# EAGLE design 64ch_16ch_adapterboard (EAGLE 7.2.0)
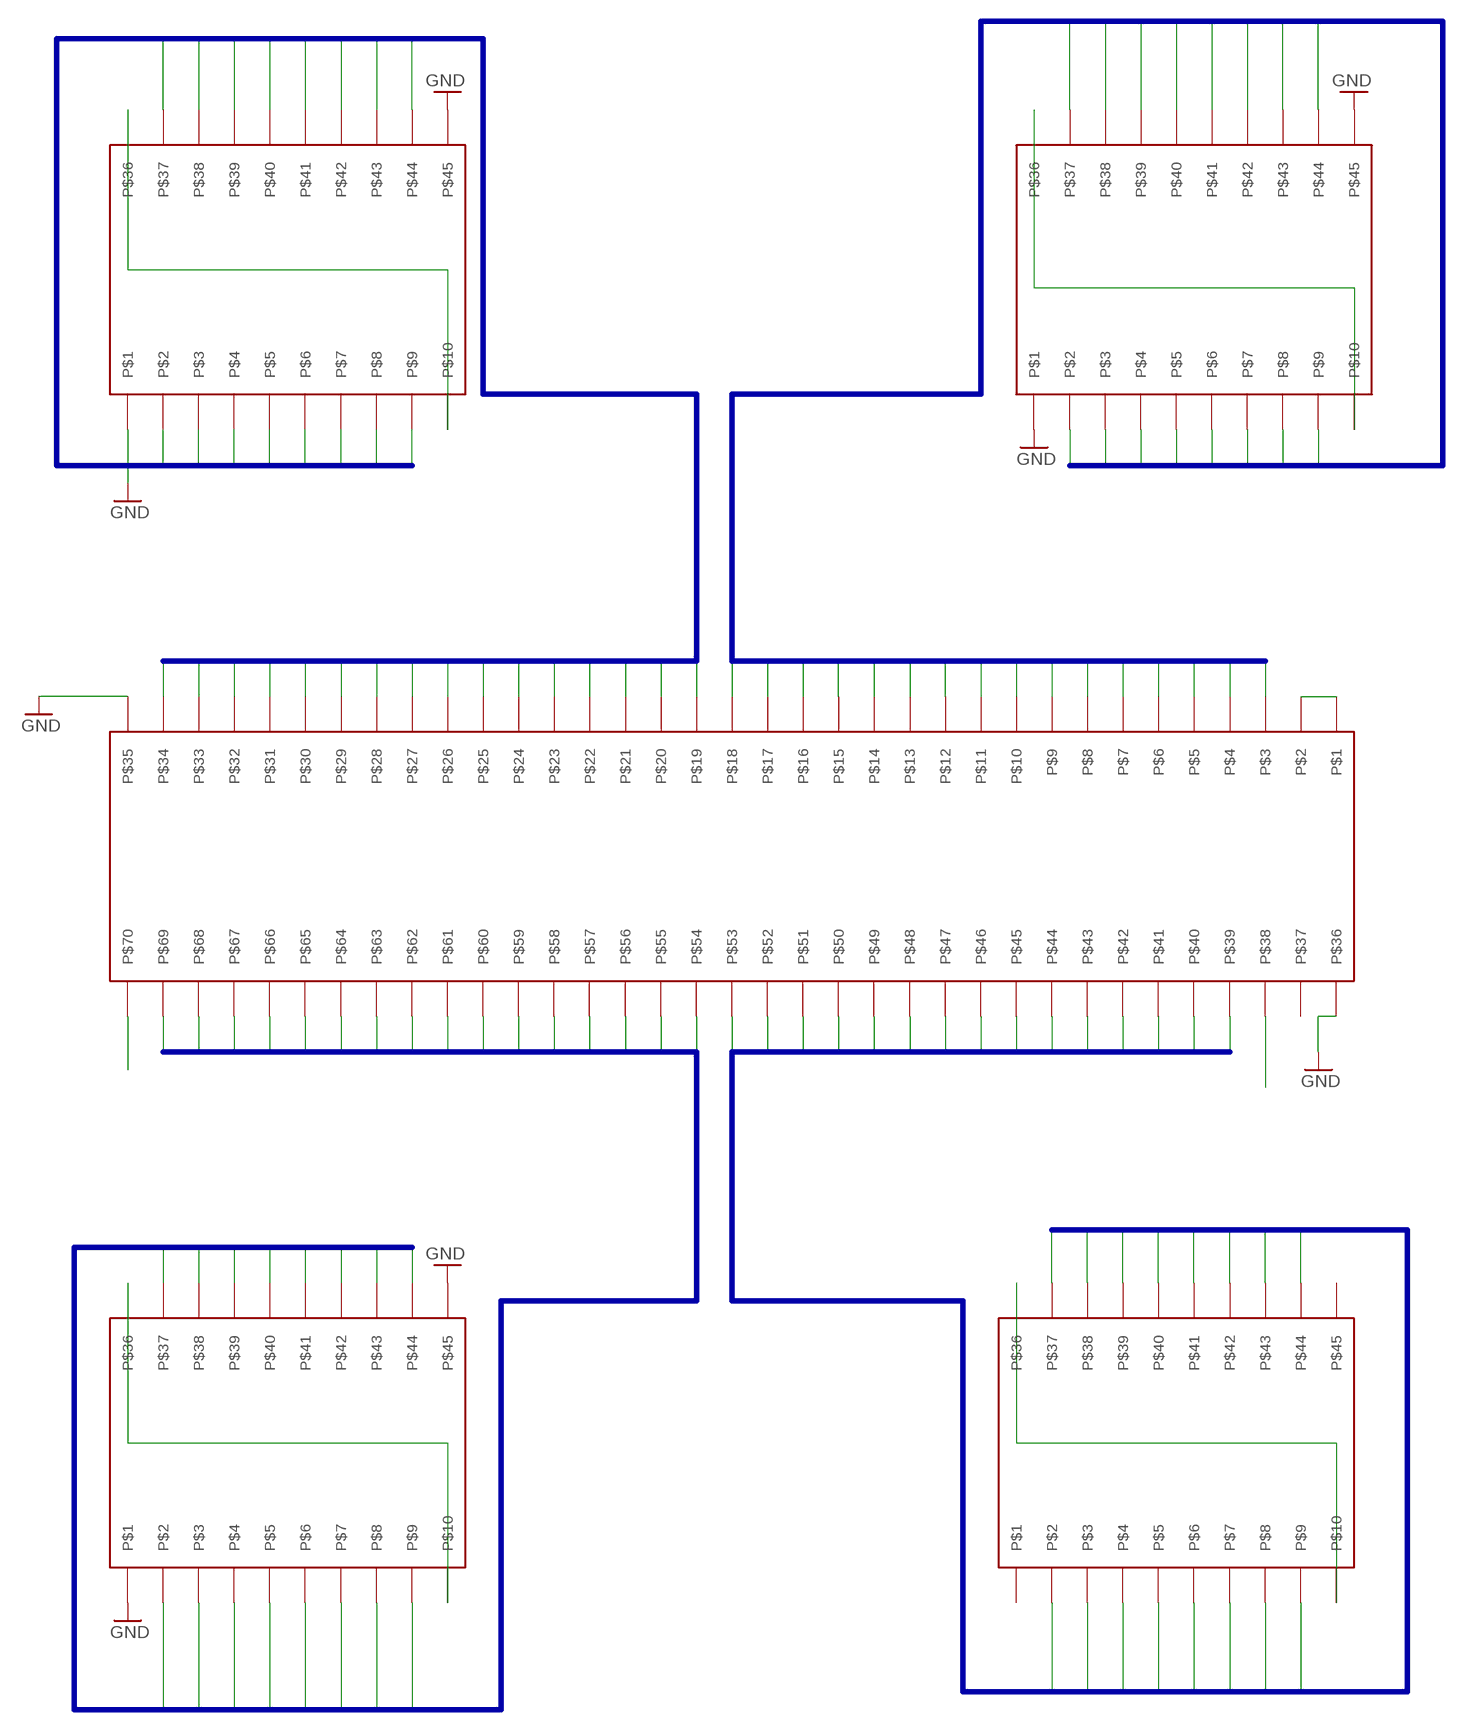
[diagram p0: schematic, sheet 1]

## Parts
U$1  HIROSE_DF40_70PIN  [HIROSE_DF40C-70DS]
U$2  HIROSE_DF40_70PIN  [HIROSE_DF40C-70DS]
U$3  HIROSE_DF40_70PIN  [HIROSE_DF40C-70DS]
U$4  HIROSE_DF40_70PIN  [HIROSE_DF40C-70DS]
U$5  HIROSE_DF40_70PIN  [HIROSE_DF40C-70DS]

## Nets
A0: U$1.P$34 U$3.P$44
A1: U$1.P$33 U$3.P$9
A2: U$1.P$32 U$3.P$8
A3: U$1.P$31 U$3.P$7
A4: U$1.P$30 U$3.P$6
A5: U$1.P$29 U$3.P$5
A6: U$1.P$28 U$3.P$4
A7: U$1.P$27 U$3.P$3
A8: U$1.P$26 U$3.P$2
A9: U$1.P$25 U$3.P$37
A10: U$1.P$22 U$3.P$38
A11: U$1.P$21 U$3.P$39
A12: U$1.P$23 U$3.P$40
A13: U$1.P$20 U$3.P$41
A14: U$1.P$24 U$3.P$42
A15: U$1.P$19 U$3.P$43
B0: U$1.P$3 U$2.P$37
B1: U$1.P$4 U$2.P$2
B2: U$1.P$5 U$2.P$3
B3: U$1.P$6 U$2.P$4
B4: U$1.P$7 U$2.P$5
B5: U$1.P$8 U$2.P$6
B6: U$1.P$9 U$2.P$7
B7: U$1.P$10 U$2.P$8
B8: U$1.P$11 U$2.P$9
B9: U$1.P$12 U$2.P$44
B10: U$1.P$15 U$2.P$43
B11: U$1.P$16 U$2.P$42
B12: U$1.P$14 U$2.P$41
B13: U$1.P$17 U$2.P$40
B14: U$1.P$13 U$2.P$39
B15: U$1.P$18 U$2.P$38
C0: U$1.P$69 U$5.P$9
C1: U$1.P$68 U$5.P$44
C2: U$1.P$67 U$5.P$43
C3: U$1.P$66 U$5.P$42
C4: U$1.P$65 U$5.P$41
C5: U$1.P$64 U$5.P$40
C6: U$1.P$63 U$5.P$39
C7: U$1.P$62 U$5.P$38
C8: U$1.P$61 U$5.P$37
C9: U$1.P$60 U$5.P$2
C10: U$1.P$57 U$5.P$3
C11: U$1.P$56 U$5.P$4
C12: U$1.P$58 U$5.P$5
C13: U$1.P$55 U$5.P$6
C14: U$1.P$59 U$5.P$7
C15: U$1.P$54 U$5.P$8
D0: U$1.P$70 U$4.P$2
D1: U$1.P$39 U$4.P$37
D2: U$1.P$40 U$4.P$38
D3: U$1.P$41 U$4.P$39
D4: U$1.P$42 U$4.P$40
D5: U$1.P$43 U$4.P$41
D6: U$1.P$44 U$4.P$42
D7: U$1.P$45 U$4.P$43
D8: U$1.P$46 U$4.P$44
D9: U$1.P$47 U$4.P$9
D10: U$1.P$50 U$4.P$8
D11: U$1.P$51 U$4.P$7
D12: U$1.P$49 U$4.P$6
D13: U$1.P$52 U$4.P$5
D14: U$1.P$48 U$4.P$4
D15: U$1.P$53 U$4.P$3
GND: U$1.P$35 U$1.P$36 U$2.P$1 U$2.P$45 U$3.P$1 U$3.P$45 U$5.P$1 U$5.P$45
REF: U$1.P$1 U$1.P$2 U$1.P$38 U$2.P$10 U$2.P$36 U$3.P$10 U$3.P$36 U$4.P$10 U$4.P$36 U$5.P$10 U$5.P$36
Unconnected: U$1.P$37 U$4.P$1 U$4.P$45

## Buses
A[0..15]
B[0..15]
C[0..15]
D[0..15]

## Library data of the parts
U$1 = GG_hirose70:HIROSE_DF40_70PIN
U$2-U$5 = GG_hirose20:HIROSE_DF40_70PIN

## Board
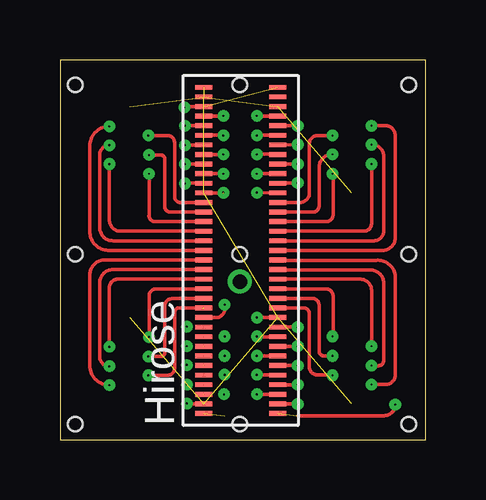
[diagram p1: board, top side]
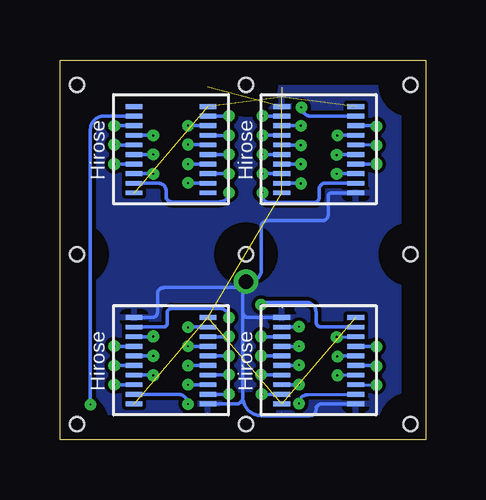
[diagram p2: board, bottom side, seen from below]

Size 15.24 x 15.85 mm. Coordinates in mm from the lower left corner, seen from the top.
Outline: 0,0 15.24,0 15.24,15.85 0,15.85 0,0
Copper layers (1*16): Top 0.035mm / dielectric 1.5mm / Bottom 0.035mm
Design rules "default *": minimum track width 6mil, minimum drill 3mil, track to track 6mil, track to pad 6mil, pad to pad 6mil, via to via 6mil, smd to smd 6mil, copper to edge 40mil, drill to drill 6mil, minimum pad ring 6mil, minimum via ring 8mil, stop-mask expansion 4mil, vias tented up to drill 0mil, thermal gap 10mil
Holes 0.6 mm at 0.64,14.81 7.49,14.81 14.53,14.81 7.49,7.75 14.53,0.66 7.49,0.66 0.64,0.66 0.64,7.75 14.53,7.75

### Footprints (pad centres in the part's own frame; a part is rotated, then mirrored left to right if it is on the bottom)
HIROSE_DF40C-70DS = smd 0.2 x 0.7: P$1 0,0; P$2 -0.4,0; P$3 -0.8,0; P$4 -1.2,0; P$5 -1.6,0; P$6 -2,0; P$7 -2.4,0; P$8 -2.8,0; P$9 -3.2,0; P$10 -3.6,0; P$11 -4,0; P$12 -4.4,0; P$13 -4.8,0; P$14 -5.2,0; P$15 -5.6,0; P$16 -6,0; P$17 -6.4,0; P$18 -6.8,0; P$19 -7.2,0; P$20 -7.6,0; P$21 -8,0; P$22 -8.4,0; P$23 -8.8,0; P$24 -9.2,0; P$25 -9.6,0; P$26 -10,0; P$27 -10.4,0; P$28 -10.8,0; P$29 -11.2,0; P$30 -11.6,0; P$31 -12,0; P$32 -12.4,0; P$33 -12.8,0; P$34 -13.2,0; P$35 -13.6,0; P$36 0,-3.08; P$37 -0.4,-3.08; P$38 -0.8,-3.08; P$39 -1.2,-3.08; P$40 -1.6,-3.08; P$41 -2,-3.08; P$42 -2.4,-3.08; P$43 -2.8,-3.08; P$44 -3.2,-3.08; P$45 -3.6,-3.08; P$46 -4,-3.08; P$47 -4.4,-3.08; P$48 -4.8,-3.08; P$49 -5.2,-3.08; P$50 -5.6,-3.08; P$51 -6,-3.08; P$52 -6.4,-3.08; P$53 -6.8,-3.08; P$54 -7.2,-3.08; P$55 -7.6,-3.08; P$56 -8,-3.08; P$57 -8.4,-3.08; P$58 -8.8,-3.08; P$59 -9.2,-3.08; P$60 -9.6,-3.08; P$61 -10,-3.08; P$62 -10.4,-3.08; P$63 -10.8,-3.08; P$64 -11.2,-3.08; P$65 -11.6,-3.08; P$66 -12,-3.08; P$67 -12.4,-3.08; P$68 -12.8,-3.08; P$69 -13.2,-3.08; P$70 -13.6,-3.08
HIROSE_DF40C-70DS' = smd 0.2 x 0.7: P$1 0,0; P$2 -0.4,0; P$3 -0.8,0; P$4 -1.2,0; P$5 -1.6,0; P$6 -2,0; P$7 -2.4,0; P$8 -2.8,0; P$9 -3.2,0; P$10 -3.6,0; P$36 0,-3.08; P$37 -0.4,-3.08; P$38 -0.8,-3.08; P$39 -1.2,-3.08; P$40 -1.6,-3.08; P$41 -2,-3.08; P$42 -2.4,-3.08; P$43 -2.8,-3.08; P$44 -3.2,-3.08; P$45 -3.6,-3.08

### Placement (x,y rotation side)
U$1  5.99,14.71 90 top
U$2  HIROSE_DF40_70PIN  [HIROSE_DF40C-70DS']  5.99,13.91 90 bottom
U$3  HIROSE_DF40_70PIN  [HIROSE_DF40C-70DS']  5.99,5.11 90 bottom
U$4  HIROSE_DF40_70PIN  [HIROSE_DF40C-70DS']  12.15,13.91 90 bottom
U$5  HIROSE_DF40_70PIN  [HIROSE_DF40C-70DS']  12.15,5.11 90 bottom

### Tracks (layer width: path | path; a pad name or v marks a point on that pad's centre or on a via)
A0  (via drill 0.08)
  Top 0.152: U$1.P$34 5.3,1.51 arc-90 v5.28,1.52
  Bottom 0.152: U$3.P$44 4.92,1.89 arc-90 v5.28,1.52
A1  (via drill 0.08)  (1 unrouted)
  Bottom 0.152: U$1.P$33 v6.83,1.91
A2  (via drill 0.08)  (1 unrouted)
  Bottom 0.152: U$1.P$32 v5.29,2.31 v5.28,2.31
A3  (via drill 0.08)  (1 unrouted)
  Bottom 0.152: U$1.P$31 6.85,2.7 v6.86,2.72
A4  (via drill 0.08)  (1 unrouted)
  Bottom 0.152: U$1.P$30 5.3,3.1 v5.28,3.12
A5  (via drill 0.08)  (1 unrouted)
  Bottom 0.152: U$1.P$29 v6.86,3.5 | v6.86,3.5
A6  (via drill 0.08)  (1 unrouted)
  Bottom 0.152: U$1.P$28 v5.29,3.91 v5.28,3.91
A7  (via drill 0.08)  (1 unrouted)
  Bottom 0.152: U$1.P$27 6.85,4.31 v6.86,4.32
A8  (via drill 0.08)  (1 unrouted)
  Bottom 0.152: U$1.P$26 5.3,4.7 v5.28,4.72
A9  (via drill 0.08)
  Top 0.152: U$1.P$25 6.58,5.11 arc90 v6.86,5.64
  Bottom 0.152: U$3.P$37 4.36,4.71 arc90 4.57,4.93 4.57,5.33 arc-90 4.98,5.74 6.76,5.74 arc-90 v6.86,5.64
A10  (via drill 0.08)
  Top 0.152: U$1.P$22 4.05,6.31 arc90 3.71,6.02 3.71,4.34 arc-90 v3.71,4.29
  Bottom 0.152: U$3.P$38 3.7,4.28 v3.71,4.29
A11  (via drill 0.08)
  Top 0.152: U$1.P$21 2.44,6.71 arc90 2.06,6.37 2.06,3.94 arc-90 v2.06,3.89
  Bottom 0.152: U$3.P$39 2.06,3.91 v2.06,3.89
A12  (via drill 0.08)
  Top 0.152: v3.68,3.48 4.17,3.48 arc90 4.37,3.63 4.37,5.61 arc-90 4.67,5.89 5.98,5.89 arc90 U$1.P$23
  Bottom 0.152: U$3.P$40 3.65,3.51 v3.68,3.48
A13  (via drill 0.08)
  Top 0.152: U$1.P$20 2.2,7.11 arc90 1.65,6.55 1.65,3.48 arc90 v2.06,3.07
  Bottom 0.152: U$3.P$41 2.07,3.11 v2.06,3.07
A14  (via drill 0.08)  (1 unrouted)
  Top 0.152: v3.68,2.69 4.47,2.69 arc90 4.78,3 4.78,5.33 arc-90 4.98,5.51 5.96,5.51
  Bottom 0.152: U$3.P$42 3.68,2.68 v3.68,2.69
A15  (via drill 0.08)
  Top 0.152: U$1.P$19 1.87,7.51 arc90 1.25,6.88 1.25,3.1 arc90 v2.06,2.29
  Bottom 0.152: U$3.P$43 v2.06,2.28 v2.06,2.29
B0  (via drill 0.08)
  Top 0.152: U$1.P$3 5.22,13.91 arc90 v5.18,13.87
  Bottom 0.152: U$2.P$37 4.8,13.51 arc90 v5.18,13.87
B1  (via drill 0.08)
  Top 0.152: U$1.P$4 v6.81,13.51
  Bottom 0.152: U$1.P$4 v6.81,13.51
B2  (via drill 0.08)
  Top 0.152: U$1.P$5 v5.21,13.11
  Bottom 0.152: U$1.P$5 v5.21,13.11 | v5.21,13.11
B3  (via drill 0.08)
  Top 0.152: U$1.P$6 v6.81,12.71 v6.81,12.7
  Bottom 0.152: U$1.P$6 v6.8,12.71 v6.81,12.7
B4  (via drill 0.08)
  Top 0.152: U$1.P$7 5.22,12.31 v5.21,12.29
  Bottom 0.152: U$1.P$7 5.22,12.31 v5.21,12.29
B5  (via drill 0.08)
  Top 0.152: U$1.P$8 v6.8,11.91 v6.81,11.91
  Bottom 0.152: U$1.P$8 v6.8,11.91 v6.81,11.91
B6  (via drill 0.08)
  Top 0.152: U$1.P$9 5.18,11.51 v5.21,11.51
  Bottom 0.152: U$1.P$9 5.18,11.51 v5.21,11.51
B7  (via drill 0.08)
  Top 0.152: U$1.P$10 6.88,11.11 v6.81,11.1
  Bottom 0.152: U$1.P$10 6.88,11.11 v6.81,11.1
B8  (via drill 0.08)
  Top 0.152: U$1.P$11 5.17,10.71 v5.21,10.69
  Bottom 0.152: U$1.P$11 5.17,10.71 v5.21,10.69
B9  (via drill 0.08)  (1 unrouted)
  Top 0.152: U$1.P$12 v6.81,10.31
  Bottom 0.152: U$2.P$44 4.2,10.71 arc-90 4.45,10.44 4.45,10.08 arc90 4.67,9.91 6.55,9.91 arc90 6.83,10.29
B10  (via drill 0.08)
  Top 0.152: U$1.P$15 3.95,9.11 arc-90 3.71,9.37 3.71,11.07 arc-90 v3.71,11.1
  Bottom 0.152: U$2.P$43 3.71,11.11 v3.71,11.1
B11  (via drill 0.08)
  Top 0.152: U$1.P$16 2.52,8.71 arc-90 2.06,9.17 v2.06,11.51
  Bottom 0.152: U$2.P$42 2.03,11.51 v2.06,11.51
B12  (via drill 0.08)
  Top 0.152: U$1.P$14 4.57,9.51 arc-90 4.37,9.75 4.37,11.71 arc90 4.19,11.89 v3.71,11.89
  Bottom 0.152: U$2.P$41 3.71,11.91 v3.71,11.89
B13  (via drill 0.08)
  Top 0.152: U$1.P$17 2.21,8.31 arc-90 1.65,8.86 1.65,11.89 arc-90 v2.06,12.29
  Bottom 0.152: U$2.P$40 2.03,12.31 v2.06,12.29
B14  (via drill 0.08)
  Top 0.152: U$1.P$13 5.08,9.91 arc-90 4.78,10.11 4.78,12.39 arc90 4.47,12.7 v3.68,12.7
  Bottom 0.152: U$2.P$39 3.68,12.71 v3.68,12.7
B15  (via drill 0.08)
  Top 0.152: U$1.P$18 2,7.91 arc-90 1.25,8.71 1.25,12.27 arc-90 v2.06,13.08
  Bottom 0.152: U$2.P$38 2.08,13.11 v2.06,13.08
C0  (via drill 0.08)
  Top 0.152: U$1.P$69 9.9,1.51 arc-90 v9.91,1.5
  Bottom 0.152: U$5.P$9 10.31,1.91 arc90 v9.91,1.5
C1  (via drill 0.08)
  Top 0.152: U$1.P$68 v8.21,1.91 arc90 v8.2,1.91
  Bottom 0.152: U$1.P$68 v8.21,1.91 arc90 v8.2,1.91
C2  (via drill 0.08)
  Top 0.152: U$1.P$67 v9.9,2.31 arc90 v9.91,2.31
  Bottom 0.152: U$1.P$67 v9.9,2.31 arc90 v9.91,2.31
C3  (via drill 0.08)
  Top 0.152: U$1.P$66 v8.22,2.71 arc-90 v8.2,2.72
  Bottom 0.152: U$1.P$66 8.22,2.7 arc-90 v8.2,2.72
C4  (via drill 0.08)
  Top 0.152: U$1.P$65 9.9,3.11 arc-90 v9.91,3.1
  Bottom 0.152: U$1.P$65 v9.9,3.1 arc-90 v9.91,3.1
C5  (via drill 0.08)
  Top 0.152: U$1.P$64 v8.21,3.51 arc90 v8.2,3.5
  Bottom 0.152: U$1.P$64 v8.2,3.5 | v8.2,3.5 arc90 v8.2,3.5
C6  (via drill 0.08)
  Top 0.152: U$1.P$63 v9.9,3.91 arc90 v9.91,3.91
  Bottom 0.152: U$1.P$63 v9.9,3.91 arc90 v9.91,3.91
C7  (via drill 0.08)
  Top 0.152: U$1.P$62 v8.22,4.31 arc-90 v8.2,4.32
  Bottom 0.152: U$1.P$62 v8.22,4.31 arc-90 v8.2,4.32
C8  (via drill 0.08)
  Top 0.152: U$1.P$61 v9.9,4.71 arc-90 v9.91,4.7
  Bottom 0.152: U$1.P$61 v9.9,4.7 arc-90 v9.91,4.7
C9  (via drill 0.08)
  Top 0.152: U$1.P$60 v8.21,5.11 arc90 v8.2,5.1
  Bottom 0.152: U$5.P$2 10.94,4.7 arc-90 10.77,4.88 10.77,5.31 arc90 10.59,5.49 8.58,5.49 arc90 v8.2,5.1
C10  (via drill 0.08)
  Top 0.152: U$1.P$57 11.07,6.31 arc-90 11.38,5.99 11.38,4.34 arc-90 v11.35,4.32
  Bottom 0.152: U$5.P$3 v11.37,4.31 arc-90 v11.35,4.32
C11  (via drill 0.08)
  Top 0.152: v12.98,3.91 12.98,6.25 arc90 12.52,6.71 U$1.P$56 arc-90 U$1.P$56
  Bottom 0.152: U$5.P$4 v12.97,3.91 arc90 v12.98,3.91
C12  (via drill 0.08)
  Top 0.152: U$1.P$58 10.48,5.91 arc-90 10.79,5.64 10.79,3.73 arc90 10.97,3.5 v11.35,3.5
  Bottom 0.152: U$5.P$5 v11.35,3.5 | v11.35,3.5 arc90 v11.35,3.5
C13  (via drill 0.08)
  Top 0.152: v12.98,3.1 13.28,3.1 arc90 13.49,3.33 13.49,6.55 arc90 12.93,7.09 9.2,7.09 arc-90 U$1.P$55
  Bottom 0.152: U$5.P$6 v12.97,3.1 arc-90 v12.98,3.1
C14  (via drill 0.08)
  Top 0.152: U$1.P$59 10.09,5.51 arc-90 10.39,5.28 10.39,3.05 arc90 10.72,2.72 11.33,2.72 arc90 v11.35,2.69
  Bottom 0.152: U$5.P$7 v11.37,2.7 arc90 v11.35,2.69
C15  (via drill 0.08)
  Top 0.152: v12.98,2.31 13.61,2.31 arc90 13.97,2.79 13.97,6.83 arc90 13.18,7.49 9.21,7.49 arc90 U$1.P$54
  Bottom 0.152: U$5.P$8 v12.97,2.31 arc90 v12.98,2.31
D0  (via drill 0.08)  (1 unrouted)
  Top 0.152: v13.97,1.47 arc-90 13.51,1.02 9.91,1.02
  Bottom 0.152: U$4.P$2 13.42,13.51 arc-90 13.97,12.95 v13.97,1.47
D1  (via drill 0.08)
  Top 0.152: U$4.P$37 v8.21,13.51 arc-90 v8.2,13.51
  Bottom 0.152: U$4.P$37 9.13,13.51 v8.2,13.51
D2  (via drill 0.08)
  Top 0.152: U$4.P$38 9.88,13.11 arc-90 v9.91,13.11
  Bottom 0.152: U$4.P$38 9.13,13.11 v9.91,13.11
D3  (via drill 0.08)
  Top 0.152: U$4.P$39 v8.21,12.71 arc90 v8.2,12.7
  Bottom 0.152: U$4.P$39 9.13,12.7 v8.2,12.7
D4  (via drill 0.08)
  Top 0.152: U$4.P$40 v9.91,12.32
  Bottom 0.152: U$4.P$40 9.13,12.32 v9.91,12.32
D5  (via drill 0.08)
  Top 0.152: U$4.P$41 9.06,11.91 v8.2,11.91
  Bottom 0.152: U$4.P$41 8.22,11.91 v8.2,11.91
D6  (via drill 0.08)
  Top 0.152: U$4.P$42 v9.91,11.51
  Bottom 0.152: U$4.P$42 9.13,11.51 v9.91,11.51
D7  (via drill 0.08)
  Top 0.152: U$4.P$43 v8.2,11.1
  Bottom 0.152: U$4.P$43 v8.2,11.1
D8  (via drill 0.08)
  Top 0.152: U$4.P$44 v9.91,10.72
  Bottom 0.152: U$4.P$44 9.13,10.72 v9.91,10.72
D9  (via drill 0.08)
  Top 0.152: U$1.P$47 v8.2,10.31
  Bottom 0.152: U$4.P$9 11.14,10.71 arc90 10.82,10.39 10.82,10.16 arc-90 10.59,9.93 8.58,9.93 arc-90 v8.2,10.31
D10  (via drill 0.08)
  Top 0.152: U$1.P$50 11.09,9.11 arc90 11.38,9.4 11.38,11.07 arc90 v11.35,11.1
  Bottom 0.152: U$4.P$8 v11.36,11.11 arc90 v11.35,11.1
D11  (via drill 0.08)
  Top 0.152: U$1.P$51 12.69,8.71 arc90 12.98,9.04 12.98,11.46 arc90 v12.98,11.51
  Bottom 0.152: U$4.P$7 v12.98,11.51 | v12.98,11.51 arc-90 v12.98,11.51
D12  (via drill 0.08)
  Top 0.152: U$1.P$49 10.55,9.51 arc90 10.79,9.75 10.79,11.35 arc-90 v11.35,11.91
  Bottom 0.152: U$4.P$6 v11.36,11.91 arc-90 v11.35,11.91
D13  (via drill 0.08)
  Top 0.152: U$1.P$52 13.06,8.31 arc90 13.49,8.69 13.49,11.86 arc90 v12.98,12.32
  Bottom 0.152: U$4.P$5 12.97,12.31 arc90 v12.98,12.32
D14  (via drill 0.08)
  Top 0.152: U$1.P$48 10.06,9.91 arc90 10.39,10.36 10.39,12.37 arc-90 10.74,12.7 v11.35,12.7
  Bottom 0.152: U$4.P$4 v11.36,12.71 arc90 v11.35,12.7
D15  (via drill 0.08)
  Top 0.152: U$1.P$53 13.39,7.91 arc90 13.97,8.41 13.97,12.73 arc90 13.51,13.11 v12.98,13.11
  Bottom 0.152: U$4.P$3 v12.98,13.11 | v12.98,13.11 arc-90 v12.98,13.11
GND  (via drill 0.6)  (2 unrouted)
  Bottom 0.152: U$5.P$1 11.4,5.1 arc-90 11.18,5.33 11.18,6.1 arc90 10.92,6.35 7.75,6.35 arc-90 v7.49,6.6 | U$2.P$45 3.92,10.31 arc-90 4.06,10.16 4.06,9.4 arc90 4.32,9.14 6.6,9.14 arc-90 6.86,8.89 6.86,6.99 arc90 v7.49,6.6 | U$3.P$1 7.39,5.1 arc90 7.62,5.33 | 7.62,5.33 7.62,6.48 arc90 v7.49,6.6 | U$5.P$45 7.89,1.5 arc-90 7.62,1.78 | 7.62,1.78 7.62,5.33 | U$3.P$45 4.34,1.5 arc-90 4.57,1.27 arc90 4.83,1.02 6.86,1.02 arc90 7.62,1.78
  pour Bottom: 0,15.75 15.24,15.75 15.24,0 0,0
REF  (10 unrouted)